# Altium schematic sheet MotorDriver.SchDoc
size A4
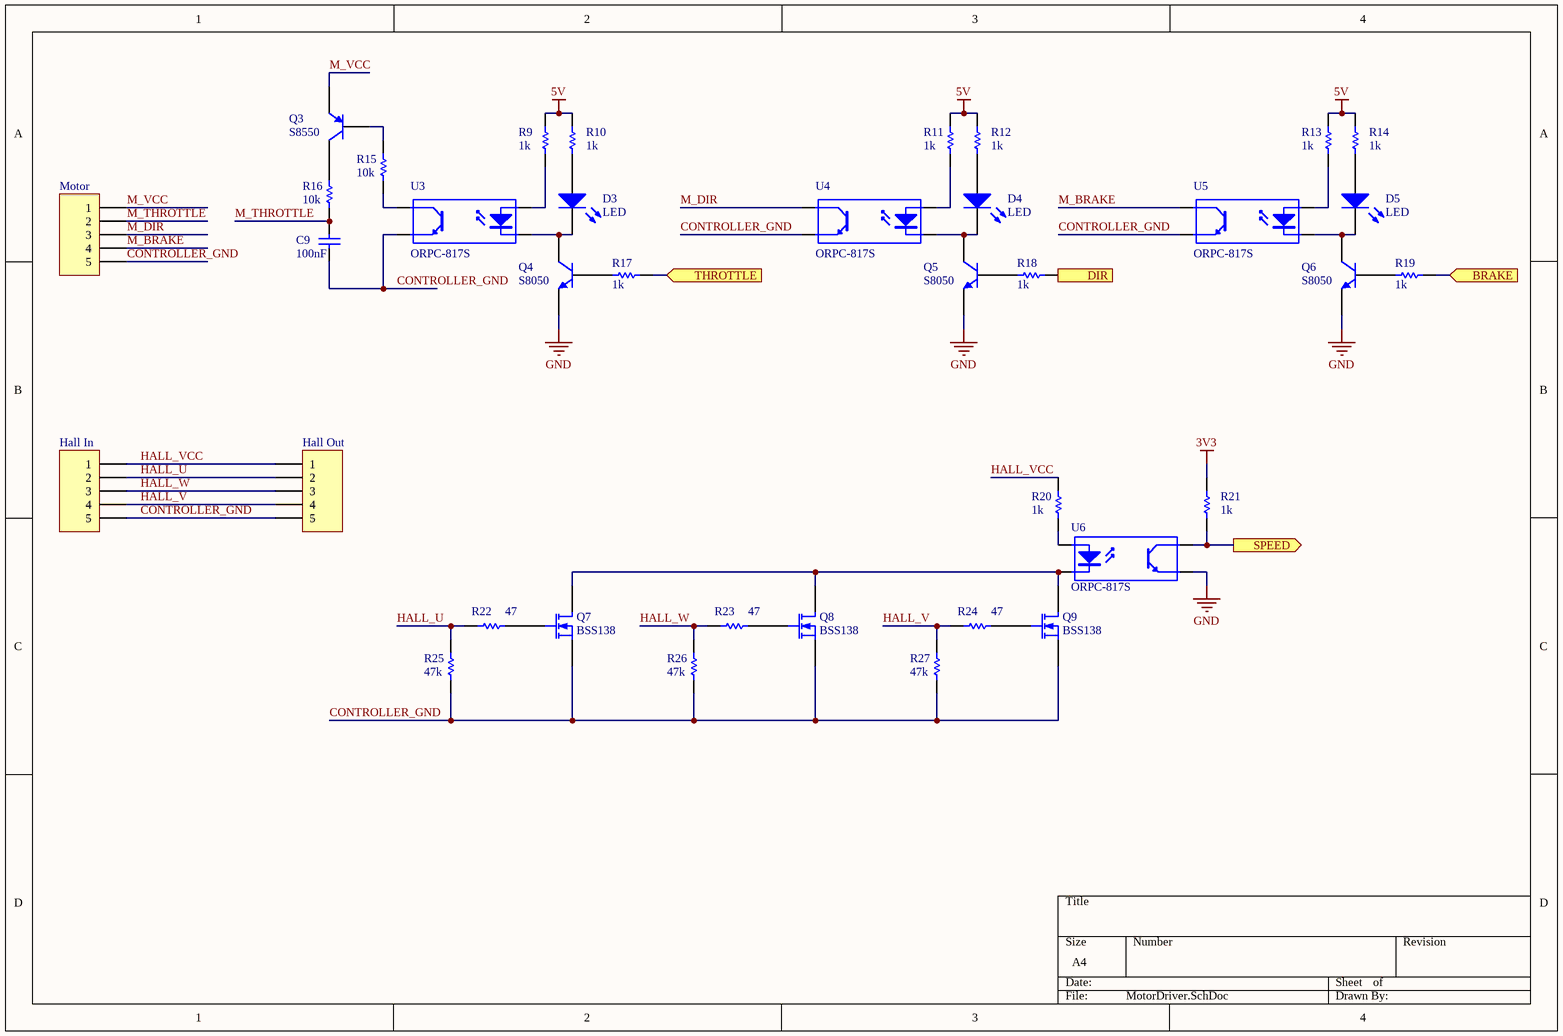
[diagram p0: MotorDriver.SchDoc]

## Parts
C9  value 100nF  [J1-0603]  (hidden comment: Cap)
D3  LED  [J1-0603 LED]
D4  LED  [J1-0603 LED]
D5  LED  [J1-0603 LED]
Hall_In  Motor 1  [HDR1X5]  (value not drawn)
Hall_Out  Motor 1  [HDR1X5]  (value not drawn)
Motor  Motor 1  [HDR1X5]  (value not drawn)
Q3  S8550  [SOT23-3M]
Q4  S8050  [SOT23-3M]
Q5  S8050  [SOT23-3M]
Q6  S8050  [SOT23-3M]
Q7  BSS138  [SOT23-3M]
Q8  BSS138  [SOT23-3M]
Q9  BSS138  [SOT23-3M]
R9  value 1k  [J1-0603]  (hidden comment: Res1)
R10  value 1k  [J1-0603]  (hidden comment: Res1)
R11  value 1k  [J1-0603]  (hidden comment: Res1)
R12  value 1k  [J1-0603]  (hidden comment: Res1)
R13  value 1k  [J1-0603]  (hidden comment: Res1)
R14  value 1k  [J1-0603]  (hidden comment: Res1)
R15  value 10k  [J1-0603]  (hidden comment: Res1)
R16  value 10k  [J1-0603]  (hidden comment: Res1)
R17  value 1k  [J1-0603]  (hidden comment: Res1)
R18  value 1k  [J1-0603]  (hidden comment: Res1)
R19  value 1k  [J1-0603]  (hidden comment: Res1)
R20  value 1k  [J1-0603]  (hidden comment: Res1)
R21  value 1k  [J1-0603]  (hidden comment: Res1)
R22  value 47  [J1-0603]  (hidden comment: Res1)
R23  value 47  [J1-0603]  (hidden comment: Res1)
R24  value 47  [J1-0603]  (hidden comment: Res1)
R25  value 47k  [J1-0603]  (hidden comment: Res1)
R26  value 47k  [J1-0603]  (hidden comment: Res1)
R27  value 47k  [J1-0603]  (hidden comment: Res1)
U3  ORPC-817S  [SMD-4]
U4  ORPC-817S  [SMD-4]
U5  ORPC-817S  [SMD-4]
U6  ORPC-817S  [SMD-4]

## Ports
BRAKE (in), DIR (in), SPEED (out), THROTTLE (in)

## Nets
3V3: R21.2
5V: R9.2 R10.2 R11.2 R12.2 R13.2 R14.2
GND: Q4.2(E) Q5.2(E) Q6.2(E) U6.3(E)
BRAKE: R19.1 ; port BRAKE
CONTROLLER_GND: C9.1 Hall_In.5 Hall_Out.5 Motor.5 Q7.2(S) Q8.2(S) Q9.2(S) R25.1 R26.1 R27.1 U3.3(E) U4.3(E) U5.3(E)
DIR: R18.1 ; port DIR
HALL_U: Hall_In.2 Hall_Out.2 R22.2 R25.2
HALL_V: Hall_In.4 Hall_Out.4 R24.2 R27.2
HALL_VCC: Hall_In.1 Hall_Out.1 R20.2
HALL_W: Hall_In.3 Hall_Out.3 R23.2 R26.2
M_BRAKE: Motor.4 U5.4(C)
M_DIR: Motor.3 U4.4(C)
M_THROTTLE: C9.2 Motor.2 R16.1
M_VCC: Motor.1 Q3.2(E)
SPEED: R21.1 U6.4(C) ; port SPEED
THROTTLE: R17.1 ; port THROTTLE
NetD3_1: D3.1(A) R10.1
NetD3_2: D3.2(K) Q4.3(C) U3.2(K)
NetD4_1: D4.1(A) R12.1
NetD4_2: D4.2(K) Q5.3(C) U4.2(K)
NetD5_1: D5.1(A) R14.1
NetD5_2: D5.2(K) Q6.3(C) U5.2(K)
NetQ3_1: Q3.1(B) R15.2
NetQ3_3: Q3.3(C) R16.2
NetQ4_1: Q4.1(B) R17.2
NetQ5_1: Q5.1(B) R18.2
NetQ6_1: Q6.1(B) R19.2
NetQ7_1: Q7.1(G) R22.1
NetQ7_3: Q7.3(D) Q8.3(D) Q9.3(D) U6.2(K)
NetQ8_1: Q8.1(G) R23.1
NetQ9_1: Q9.1(G) R24.1
NetR9_1: R9.1 U3.1(A)
NetR11_1: R11.1 U4.1(A)
NetR13_1: R13.1 U5.1(A)
NetR15_1: R15.1 U3.4(C)
NetR20_1: R20.1 U6.1(A)

## Library data of the parts
C9 = Cap: Capacitor; Published: 8-Jun-2000; LatestRevisionDate: 17-Jul-2002; LatestRevisionNote: Re-released for DXP Platform.; PackageReference: RAD-0.3; Publisher: Altium Limited; PackageDescription: Radial Cap, Thru-Hole; 2 Leads; 0.3 in Pin Spacing; LCSC: C153795
Hall_In Hall_Out Motor = Header 5: Control Signals from a E-Bike controller; LatestRevisionDate: 17-Jul-2002; LatestRevisionNote: Re-released for DXP Platform.; Publisher: Altium Limited
Q3 = S8550: PNP General Purpose Amplifier; Published: 8-Jun-2000; LatestRevisionDate: 15-Jan-2003; LatestRevisionNote: PCB Footprint 'BCY-W3/D4.7' replaced; DatasheetVersion: 1997; PackageVersion: Sep-1998; PackageReference: TO-92A; Publisher: Altium Limited; PackageDescription: TO, Flat Index; 3 In-Line, Axial Leads; Body Dia. 4.5mm; Leads 0.51 x 0.48 mm (max); LCSC: C111271
Q4-Q6 = S8050: NPN General Purpose Amplifier; Published: 8-Jun-2000; LatestRevisionDate: 15-Jan-2003; LatestRevisionNote: PCB Footprint 'BCY-W3/D4.7' replaced; DatasheetVersion: 1997; PackageVersion: Sep-1998; PackageReference: TO-92A; Publisher: Altium Limited; PackageDescription: TO, Flat Index; 3 In-Line, Axial Leads; Body Dia. 4.5mm; Leads 0.51 x 0.48 mm (max); LCSC: C259988
Q7-Q9 = BSS138: N-Channel MOSFET; Published: 8-Jun-2000; LatestRevisionDate: 17-Jul-2002; LatestRevisionNote: Re-released for DXP Platform.; PackageVersion: 1995/1996; PackageReference: E3; Publisher: Altium Limited; PackageDescription: TO, Flat Index; 3 In-Line, Axial Leads; Body Dia. 4.6mm; Lead Dia. 0.5 mm (max); LCSC: C112239
R9-R27 = Res1: Resistor; Published: 8-Jun-2000; LatestRevisionDate: 17-Jul-2002; LatestRevisionNote: Re-released for DXP Platform.; PackageReference: AXIAL-0.3; Publisher: Altium Limited; PackageDescription: Axial Device, Thru-Hole; 2 Leads; 0.3 in Pin Spacing
U3-U6 = ORPC-817S: 4-Pin Phototransistor Optocoupler; Published: 24-Mar-1999; LatestRevisionDate: 04-Mar-2005; LatestRevisionNote: Sch pins 3 & 4 Swapped.; DatasheetVersion: Nov-2003; PackageReference: DIP-4; Publisher: Altium Limited
  U3-U5: LCSC: C231233
D3-D5 = LED: Published: 8-Jun-2000; LatestRevisionDate: 17-Jul-2002; LatestRevisionNote: Re-released for DXP Platform.; PackageVersion: Feb-2002; PackageReference: 3.2X1.6X1.1; Publisher: Altium Limited; PackageDescription: SM LED; 2 Flat Leads; LCSC: C205450